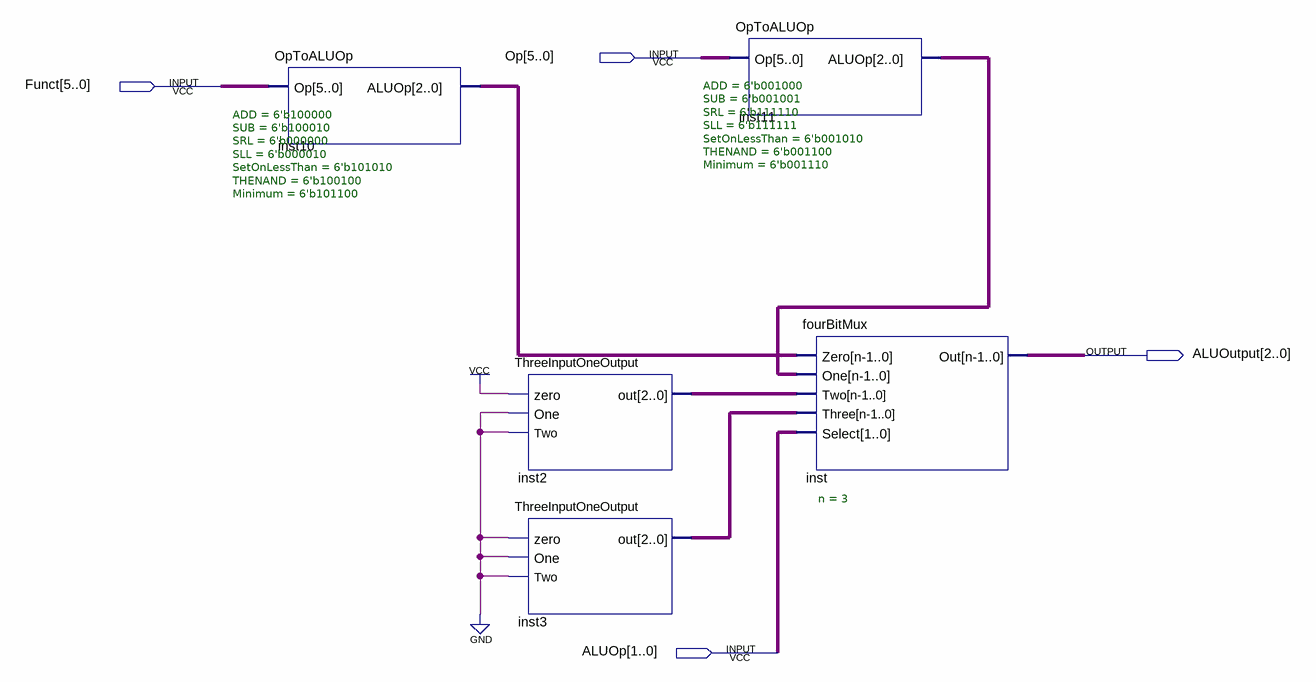
[diagram p0: schematic sheet]
// Quartus schematic ALUControl.bdf as structural Verilog: 5 symbols, 4 pins
module ALUControl (
  input  [5:0] Op,
  input  [5:0] Funct,
  input  [1:0] ALUOp,
  output [2:0] ALUOutput
);

  wire [2:0] inst2_out, inst3_out, inst10_aluop, inst11_aluop;

  OpToALUOp #(.ADD(6'b100000), .SUB(6'b100010), .SRL(6'b000000), .SLL(6'b000010), .SetOnLessThan(6'b101010), .THENAND(6'b100100), .Minimum(6'b101100)) inst10 (
    .Op(Funct), .ALUOp(inst10_aluop));
  ThreeInputOneOutput inst2 (.zero(1'b1), .One(1'b0), .Two(1'b0), .out(inst2_out));
  ThreeInputOneOutput inst3 (.zero(1'b0), .One(1'b0), .Two(1'b0), .out(inst3_out));
  OpToALUOp #(.ADD(6'b001000), .SUB(6'b001001), .SRL(6'b111110), .SLL(6'b111111), .SetOnLessThan(6'b001010), .THENAND(6'b001100), .Minimum(6'b001110)) inst11 (
    .Op(Op), .ALUOp(inst11_aluop));
  fourBitMux #(.n(3)) inst (
    .Zero(inst10_aluop), .One(inst11_aluop), .Two(inst2_out), .Three(inst3_out), .Select(ALUOp),
    .Out(ALUOutput));
endmodule
